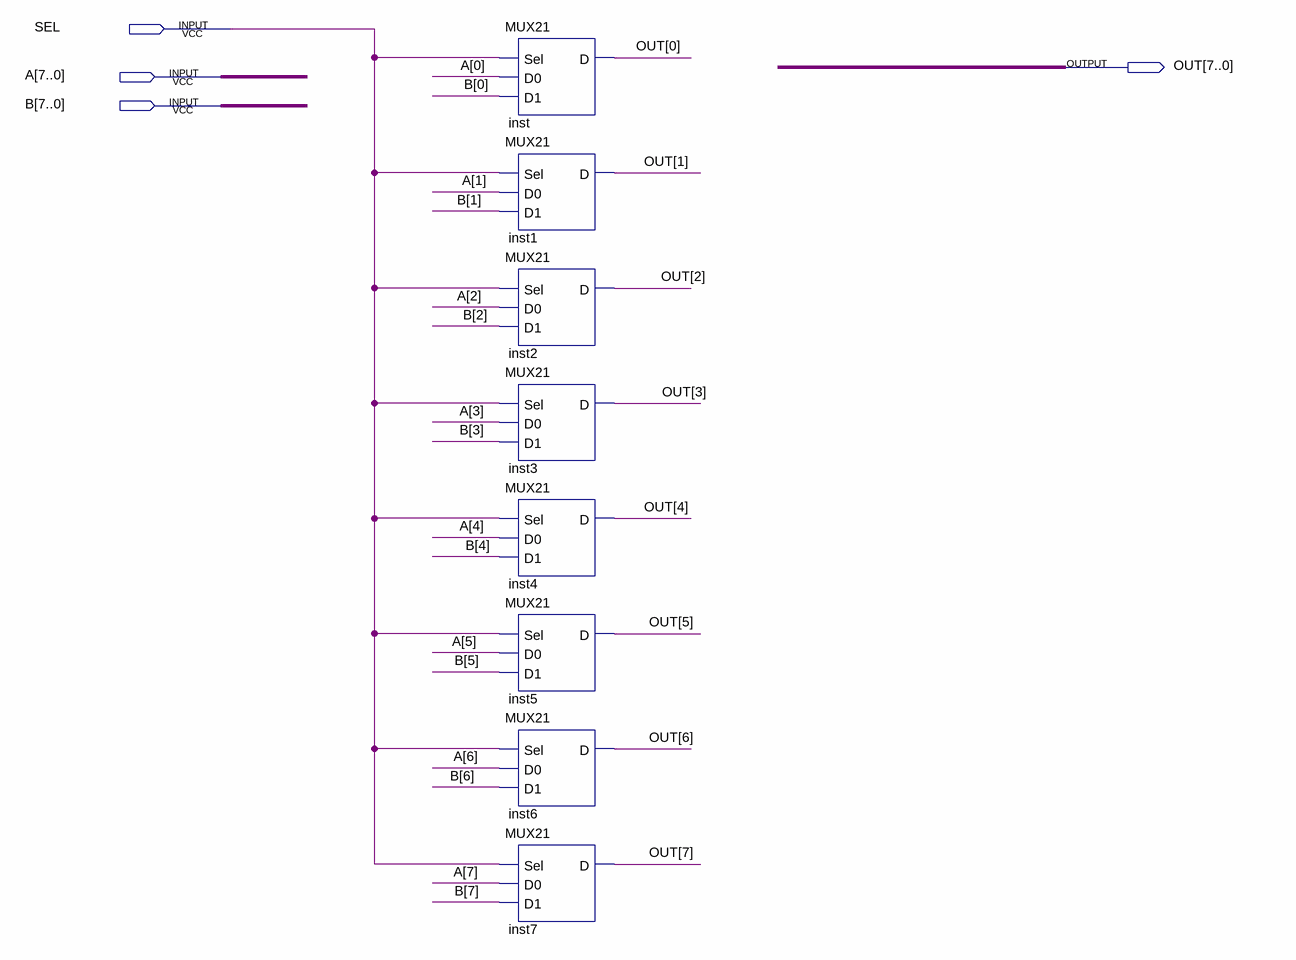
[diagram p0: schematic sheet]
// Quartus schematic MUX21_8BIT.bdf as structural Verilog: 8 symbols, 4 pins
module MUX21_8BIT (
  input  SEL,
  input  [7:0] A,
  input  [7:0] B,
  output [7:0] OUT
);

  MUX21 inst (.D0(A[0]), .Sel(SEL), .D1(B[0]), .D(OUT[0]));
  MUX21 inst1 (.D0(A[1]), .Sel(SEL), .D1(B[1]), .D(OUT[1]));
  MUX21 inst2 (.D0(A[2]), .Sel(SEL), .D1(B[2]), .D(OUT[2]));
  MUX21 inst3 (.D0(A[3]), .Sel(SEL), .D1(B[3]), .D(OUT[3]));
  MUX21 inst4 (.D0(A[4]), .Sel(SEL), .D1(B[4]), .D(OUT[4]));
  MUX21 inst5 (.D0(A[5]), .Sel(SEL), .D1(B[5]), .D(OUT[5]));
  MUX21 inst6 (.D0(A[6]), .Sel(SEL), .D1(B[6]), .D(OUT[6]));
  MUX21 inst7 (.D0(A[7]), .Sel(SEL), .D1(B[7]), .D(OUT[7]));
endmodule
